# EAGLE design Adafruit HaD Proto HAT rev A (EAGLE 8.5.0)
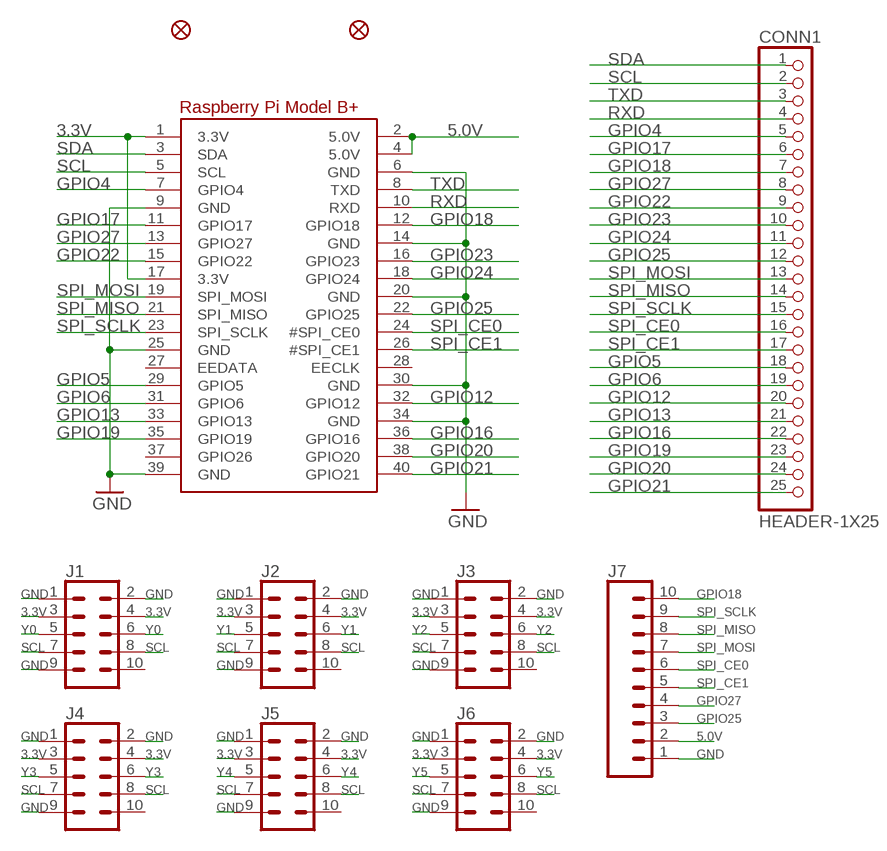
[diagram p0: schematic, sheet 1]

## Parts
CONN1  HEADER-1X25  [1X25_ROUND_70MIL]
FID2  FIDUCIAL""  [FIDUCIAL_1MM]
FID3  FIDUCIAL""  [FIDUCIAL_1MM]
J1  CONN_05X2SHD  [2X5-SHROUDED]
J2  CONN_05X2SHD  [2X5-SHROUDED]
J3  CONN_05X2SHD  [2X5-SHROUDED]
J4  CONN_05X2SHD  [2X5-SHROUDED]
J5  CONN_05X2SHD  [2X5-SHROUDED]
J6  CONN_05X2SHD  [2X5-SHROUDED]
J7  CONN_10LOCK  [1X10_LOCK]
RPI1  RASPBERRYPI_BPLUS_HATNOSLOTS  [PI_HAT_NOSLOTS]

## Nets
3.3V [power]: J1.3 J1.4 J2.3 J2.4 J3.3 J3.4 J4.3 J4.4 J5.3 J5.4 J6.3 J6.4 RPI1.1(3.3V) RPI1.17(3.3V)
5.0V [power]: J7.2 RPI1.2(5.0V) RPI1.4(5.0V)
GND [power]: J1.1 J1.2 J1.9 J2.1 J2.2 J2.9 J3.1 J3.2 J3.9 J4.1 J4.2 J4.9 J5.1 J5.2 J5.9 J6.1 J6.2 J6.9 J7.1 RPI1.6(GND) RPI1.9(GND) RPI1.14(GND) RPI1.20(GND) RPI1.25(GND) RPI1.30(GND) RPI1.34(GND) RPI1.39(GND)
GPIO4: CONN1.5 RPI1.7(GPIO4)
GPIO5: CONN1.18 RPI1.29(GPIO5)
GPIO6: CONN1.19 RPI1.31(GPIO6)
GPIO12: CONN1.20 RPI1.32(GPIO12)
GPIO13: CONN1.21 RPI1.33(GPIO13)
GPIO16: CONN1.22 RPI1.36(GPIO16)
GPIO17: CONN1.6 RPI1.11(GPIO17)
GPIO18: CONN1.7 J7.10 RPI1.12(GPIO18)
GPIO19: CONN1.23 RPI1.35(GPIO19)
GPIO20: CONN1.24 RPI1.38(GPIO20)
GPIO21: CONN1.25 RPI1.40(GPIO21)
GPIO22: CONN1.9 RPI1.15(GPIO22)
GPIO23: CONN1.10 RPI1.16(GPIO23)
GPIO24: CONN1.11 RPI1.18(GPIO24)
GPIO25: CONN1.12 J7.3 RPI1.22(GPIO25)
GPIO27: CONN1.8 J7.4 RPI1.13(GPIO27)
RXD: CONN1.4 RPI1.10(RXD)
SCL: CONN1.2 J1.7 J1.8 J2.7 J2.8 J3.7 J3.8 J4.7 J4.8 J5.7 J5.8 J6.7 J6.8 RPI1.5(SCL)
SDA: CONN1.1 RPI1.3(SDA)
SPI_CE0: CONN1.16 J7.6 RPI1.24(#SPI_CE0)
SPI_CE1: CONN1.17 J7.5 RPI1.26(#SPI_CE1)
SPI_MISO: CONN1.14 J7.8 RPI1.21(SPI_MISO)
SPI_MOSI: CONN1.13 J7.7 RPI1.19(SPI_MOSI)
SPI_SCLK: CONN1.15 J7.9 RPI1.23(SPI_SCLK)
TXD: CONN1.3 RPI1.8(TXD)
Y0 [power]: J1.5 J1.6
Y1 [power]: J2.5 J2.6
Y2 [power]: J3.5 J3.6
Y3 [power]: J4.5 J4.6
Y4 [power]: J5.5 J5.6
Y5 [power]: J6.5 J6.6
Unconnected: J1.10 J2.10 J3.10 J4.10 J5.10 J6.10 RPI1.27(EEDATA) RPI1.28(EECLK) RPI1.37(GPIO26)

## Library data of the parts
CONN1 = microbuilder:HEADER-1X25
FID2 FID3 = microbuilder:FIDUCIAL: Fiducial Alignment Points Various fiducial points for machine vision alignment.; BOM: EXCLUDE
J1-J6 = SparkFun-Connectors:CONN_05X2: Multi connection point. Often used as Generic Header-pin footprint for 0.1 inch spaced/style header connections For AVR SPI programming port, see special device with nice symbol: "AVR_SPI_PROG_5x2.dev" You can populate with any combo of single row headers, but if you'd like an exact match, check these: 2x5 AVR ICSP Male Header <https://www.sparkfun.com/products/778> (PRT-00778) 2x5 Pin Shrouded Header <https://www.sparkfun.com/products/8506> (PRT-08506) On any of the 0.1 inch spaced packages, you can populate with these: Break Away Headers - Straight <https://www.sparkfun.com/products/116> (PRT-00116) Break Away Male Headers - Right Angle <https://www.sparkfun.com/products/553> (PRT-00553) Female Headers <https://www.sparkfun.com/products/115> (PRT-00115) Break Away Headers - Machine Pin <https://www.sparkfun.com/products/117> (PRT-00117) Break Away Female Headers - Swiss Machine Pin <https://www.sparkfun.com/products/743> (PRT-00743) Special note: the shrouded connector mates well with our 5x2 ribbon cables: 2x5 Pin IDC Ribbon Cable <https://www.sparkfun.com/products/8535> (PRT-08535); PROD_ID: CONN-08671; SF_ID: PRT-08506
J7 = SparkFun-Connectors:CONN_10: Multi connection point. Often used as Generic Header-pin footprint for 0.1 inch spaced/style header connections On any of the 0.1 inch spaced packages, you can populate with these: Break Away Headers - Straight <https://www.sparkfun.com/products/116> (PRT-00116) Break Away Male Headers - Right Angle <https://www.sparkfun.com/products/553> (PRT-00553) Female Headers <https://www.sparkfun.com/products/115> (PRT-00115) Break Away Headers - Machine Pin <https://www.sparkfun.com/products/117> (PRT-00117) Break Away Female Headers - Swiss Machine Pin <https://www.sparkfun.com/products/743> (PRT-00743) Arduino Stackable Header - 10 Pin <https://www.sparkfun.com/products/11376> (PRT-11376) For SCREWTERMINALS and SPRING TERMINALS visit here: Screw Terimnals on SparkFun.com <https://www.sparkfun.com/search/results?term=Screw+Terminals> (5mm/3.5mm/2.54mm spacing) This device is also useful as a general connection point to wire up your design to another part of your project. Our various solder wires solder well into these plated through hole pads. Hook-Up Wire - Assortment (Stranded, 22 AWG) <https://www.sparkfun.com/products/11375> (PRT-11375) Hook-Up Wire - Assortment (Solid Core, 22 AWG) <https://www.sparkfun.com/products/11367> (PRT-11367) View the entire wire category on our website here <https://www.sparkfun.com/categories/141> Special notes: Molex polarized connector foot print use with SKU : PRT-08231 with associated crimp pins and housings. 1MM SMD Version SKU: PRT-10208 NOTES ON THE VARIANTS LOCK and LOCK_LONGPADS... This footprint was designed to help hold the alignment of a through-hole component (i.e. 6-pin header) while soldering it into place. You may notice that each hole has been shifted either up or down by 0.005 of an inch from it's more standard position (which is a perfectly straight line). This slight alteration caused the pins (the squares in the middle) to touch the edges of the holes. Because they are alternating, it causes a "brace" to hold the component in place. 0.005 has proven to be the perfect amount of "off-center" position when using our standard breakaway headers. Although looks a little odd when you look at the bare footprint, once you have a header in there, the alteration is very hard to notice. Also,if you push a header all the way into place, it is covered up entirely on the bottom side.
RPI1 = microbuilder:RASPBERRYPI_BPLUS

## Net classes
0 default: width 0.305 mm, clearance 0.254 mm
1 power: width 0.406 mm, clearance 0.254 mm

## Board
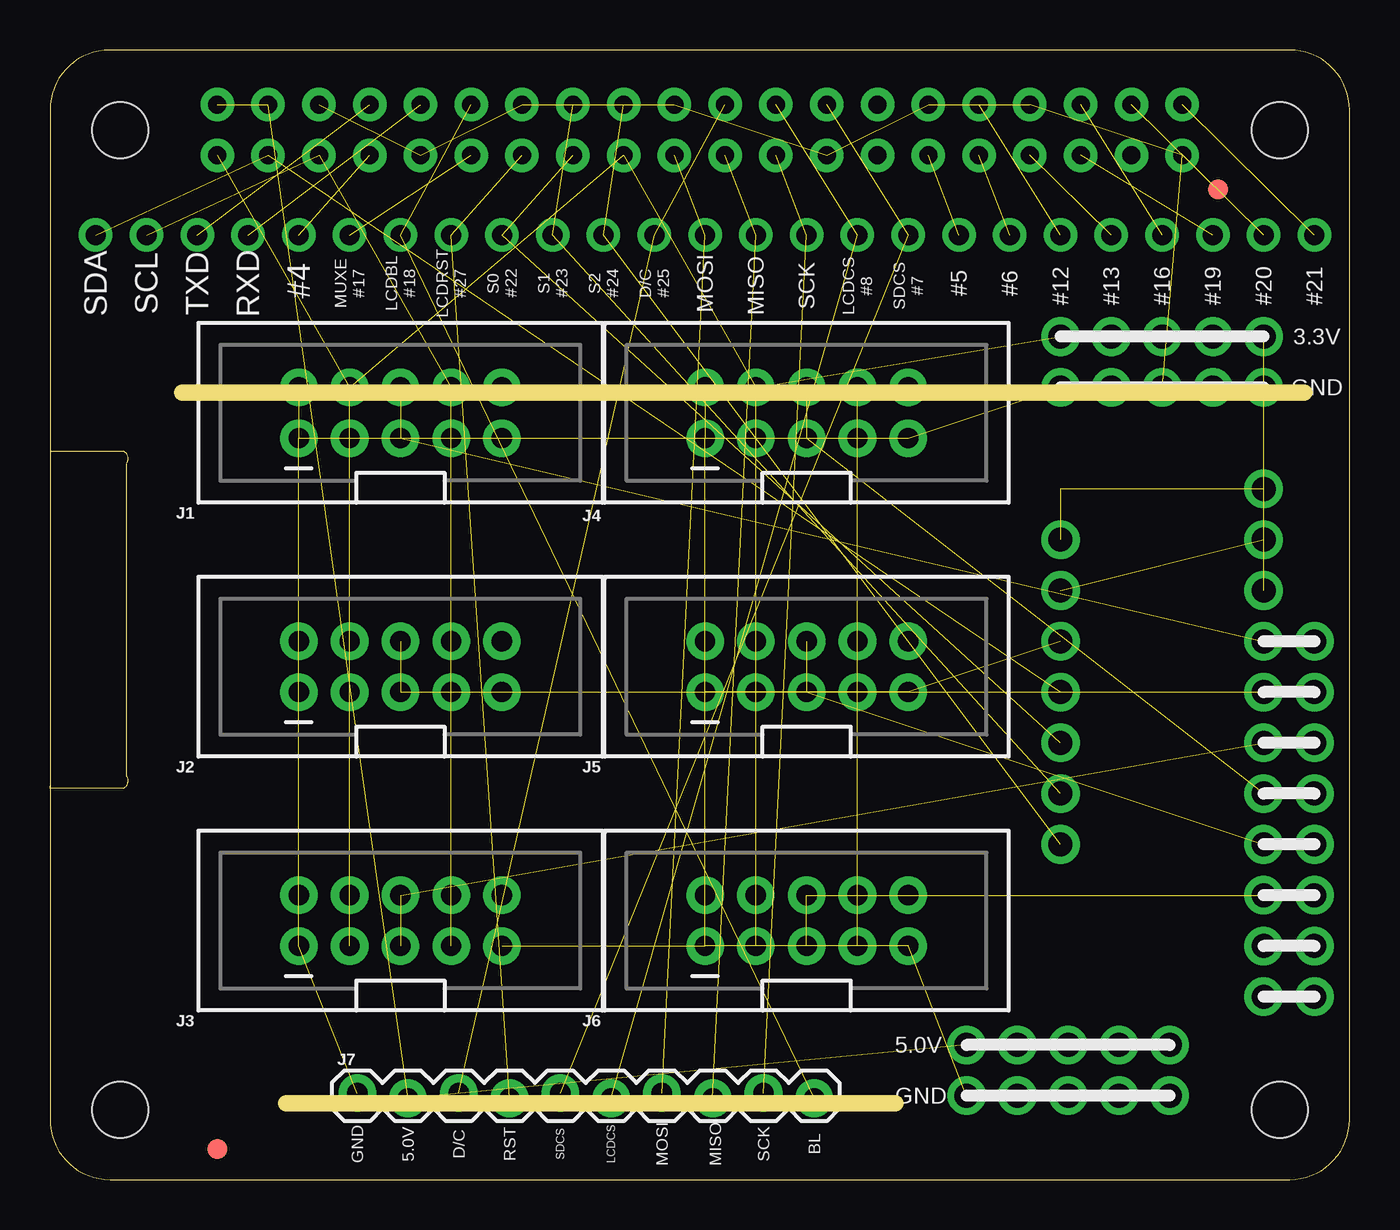
[diagram p1: board, top side]
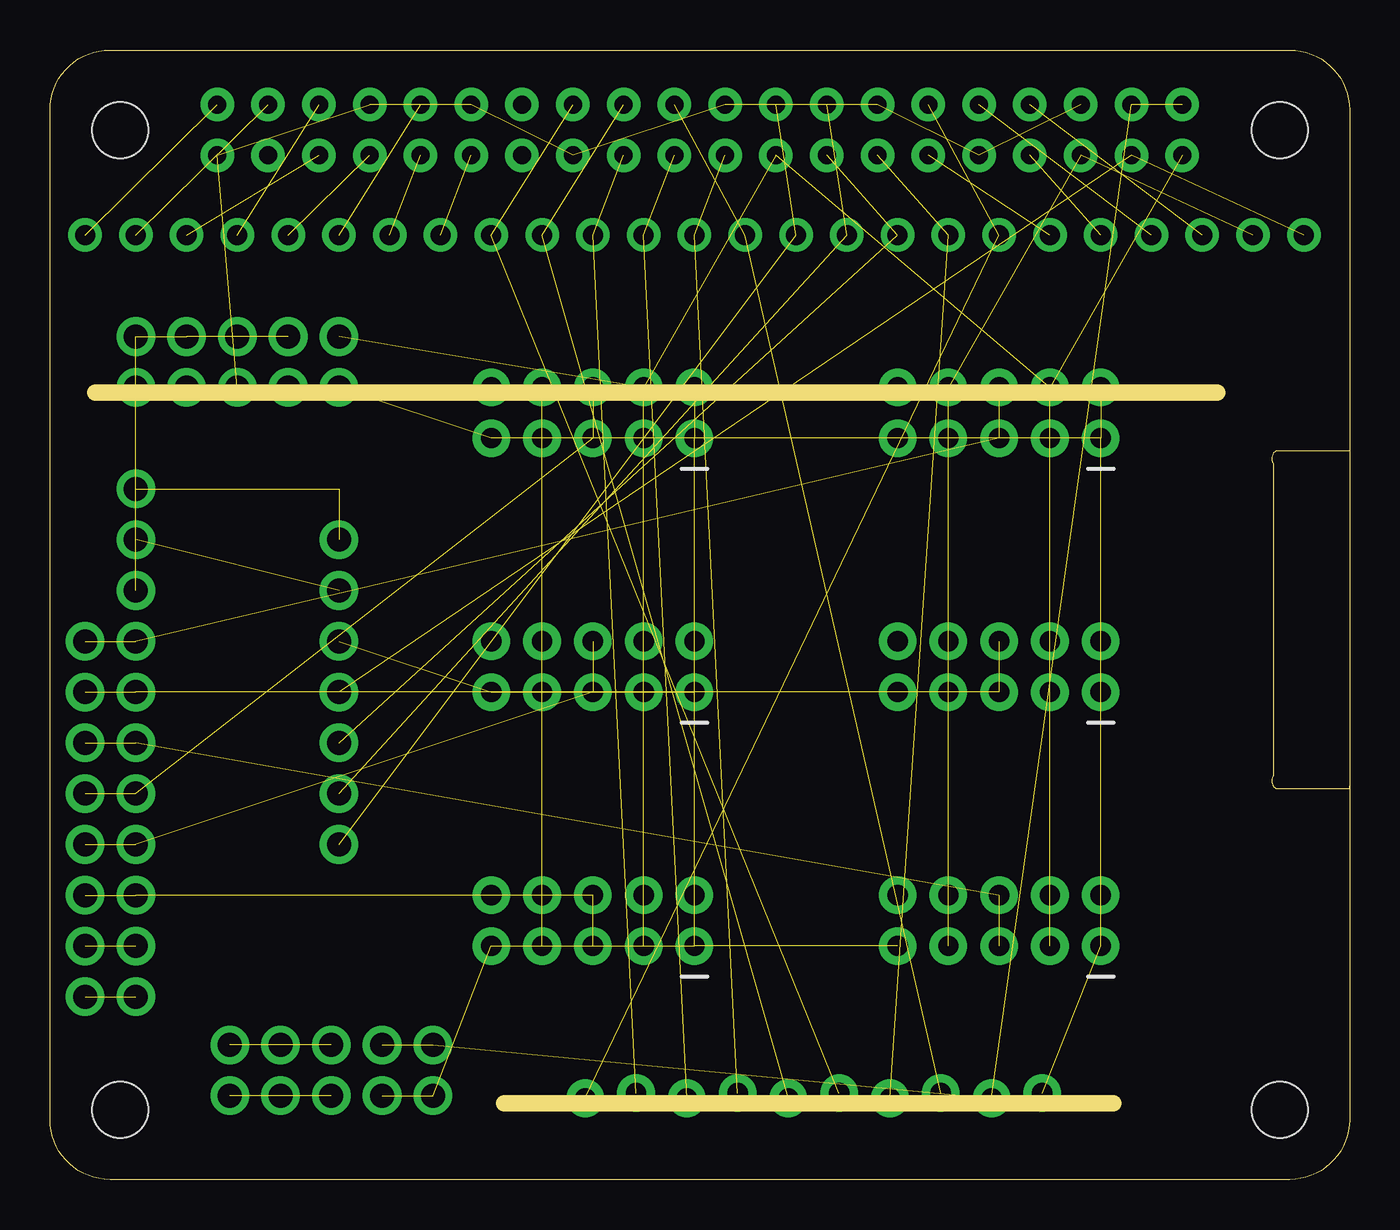
[diagram p2: board, bottom side, seen from below]

Size 65 x 56.5 mm. Coordinates in mm from the lower left corner, seen from the top.
Outline: 0,36.45 3.68,36.45 arc-90 3.81,35.81 3.81,20.19 arc-90 3.68,19.56 0,19.56 0,19.68
Copper layers (1*16): Top 0.035mm / dielectric 1.5mm / Bottom 0.035mm
Design rules "SparkFun": minimum track width 8mil, minimum drill 20mil, track to track 8mil, track to pad 8mil, pad to pad 8mil, via to via 8mil, smd to smd 8mil, copper to edge 10mil, drill to drill 8mil, minimum pad ring 12mil, minimum via ring 10mil, stop-mask expansion 4mil, vias tented up to drill 25mil, thermal gap 10mil
Milling: 2 lines

### Footprints (pad centres in the part's own frame; a part is rotated, then mirrored left to right if it is on the bottom)
1X25_ROUND_70MIL = drill 1 pad 1.676: 1 -30.48,0; 2 -27.94,0; 3 -25.4,0; 4 -22.86,0; 5 -20.32,0; 6 -17.78,0; 7 -15.24,0; 8 -12.7,0; 9 -10.16,0; 10 -7.62,0; 11 -5.08,0; 12 -2.54,0; 13 0,0; 14 2.54,0; 15 5.08,0; 16 7.62,0; 17 10.16,0; 18 12.7,0; 19 15.24,0; 20 17.78,0; 21 20.32,0; 22 22.86,0; 23 25.4,0; 24 27.94,0; 25 30.48,0
FIDUCIAL_1MM = smd 1 x 1: 1 0,0
2X5-SHROUDED = drill 1.016 pad 1.88: 1 -1.27,5.08; 2 1.27,5.08; 3 -1.27,2.54; 4 1.27,2.54; 5 -1.27,0; 6 1.27,0; 7 -1.27,-2.54; 8 1.27,-2.54; 9 -1.27,-5.08; 10 1.27,-5.08
1X10_LOCK = drill 1.016 pad 1.88: 1 0,0.127; 2 2.54,-0.127; 3 5.08,0.127; 4 7.62,-0.127; 5 10.16,0.127; 6 12.7,-0.127; 7 15.24,0.127; 8 17.78,-0.127; 9 20.32,0.127; 10 22.86,-0.127
PI_HAT_NOSLOTS = drill 0.9 pad 1.676: 1 8.37,51.23; 2 8.37,53.77; 3 10.91,51.23; 4 10.91,53.77; 5 13.45,51.23; 6 13.45,53.77; 7 15.99,51.23; 8 15.99,53.77; 9 18.53,51.23; 10 18.53,53.77; 11 21.07,51.23; 12 21.07,53.77; 13 23.61,51.23; 14 23.61,53.77; 15 26.15,51.23; 16 26.15,53.77; 17 28.69,51.23; 18 28.69,53.77; 19 31.23,51.23; 20 31.23,53.77; 21 33.77,51.23; 22 33.77,53.77; 23 36.31,51.23; 24 36.31,53.77; 25 38.85,51.23; 26 38.85,53.77; 27 41.39,51.23; 28 41.39,53.77; 29 43.93,51.23; 30 43.93,53.77; 31 46.47,51.23; 32 46.47,53.77; 33 49.01,51.23; 34 49.01,53.77; 35 51.55,51.23; 36 51.55,53.77; 37 54.09,51.23; 38 54.09,53.77; 39 56.63,51.23; 40 56.63,53.77 | hole 2.8: 3.5,3.5; 3.5,52.5; 61.5,52.5; 61.5,3.5

### Placement (x,y rotation side)
CONN1  32.77,47.24 0 top
FID2  8.38,1.52 0 top
FID3  58.42,49.53 0 top
J1  17.53,38.35 90 top
J2  17.53,25.65 90 top
J3  17.53,12.95 90 top
J4  37.85,38.35 90 top
J5  37.85,25.65 90 top
J6  37.85,12.95 90 top
J7  15.37,4.19 0 top
RPI1  0,0 0 top

### Tracks (layer width: path | path; a pad name or v marks a point on that pad's centre or on a via)
3.3V  (via drill 1.2 pad 1.93)  (19 unrouted)
  Top 0.406: v60.71,42.16 v50.55,42.16
  other vias: 60.71,32 50.55,29.46 53.09,42.16 55.63,42.16 58.17,42.16
5.0V  (via drill 1.2 pad 1.93)  (6 unrouted)
  Top 0.406: v45.85,6.73 v56.01,6.73
  other vias: 48.39,6.73 50.93,6.73 53.47,6.73
GND  (via drill 1.2 pad 1.93)  (37 unrouted)
  Top 0.406: v56.01,4.19 v45.85,4.19
  other vias: 60.71,29.46 50.55,26.92 50.55,39.62 53.09,39.62 55.63,39.62 58.17,39.62 60.71,39.62 48.39,4.19 50.93,4.19 53.47,4.19
GPIO4  (1 unrouted)
GPIO5  (1 unrouted)
GPIO6  (1 unrouted)
GPIO12  (1 unrouted)
GPIO13  (1 unrouted)
GPIO16  (1 unrouted)
GPIO17  (1 unrouted)
GPIO18  (2 unrouted)
GPIO19  (1 unrouted)
GPIO20  (1 unrouted)
GPIO21  (1 unrouted)
GPIO22  (via drill 1.2 pad 1.93)  (2 unrouted)
  other vias: 50.55,21.84
GPIO23  (via drill 1.2 pad 1.93)  (2 unrouted)
  other vias: 50.55,19.3
GPIO24  (via drill 1.2 pad 1.93)  (2 unrouted)
  other vias: 50.55,16.76
GPIO25  (2 unrouted)
GPIO27  (2 unrouted)
RXD  (1 unrouted)
SCL  (13 unrouted)
SDA  (via drill 1.2 pad 1.93)  (2 unrouted)
  other vias: 50.55,24.38
SPI_CE0  (2 unrouted)
SPI_CE1  (2 unrouted)
SPI_MISO  (2 unrouted)
SPI_MOSI  (2 unrouted)
SPI_SCLK  (2 unrouted)
TXD  (1 unrouted)
VEE  (via drill 1.2 pad 1.93)  (2 unrouted)
  other vias: 60.71,34.54 50.55,32
Y0  (via drill 1.2 pad 1.93)  (3 unrouted)
  other vias: 63.25,26.92 60.71,26.92
Y1  (via drill 1.2 pad 1.93)  (3 unrouted)
  other vias: 63.25,24.38 60.71,24.38
Y2  (via drill 1.2 pad 1.93)  (5 unrouted)
  other vias: 63.25,21.84 60.71,21.84
Y3  (via drill 1.2 pad 1.93)  (3 unrouted)
  other vias: 63.25,19.3 60.71,19.3
Y4  (via drill 1.2 pad 1.93)  (3 unrouted)
  other vias: 63.25,16.76 60.71,16.76
Y5  (via drill 1.2 pad 1.93)  (3 unrouted)
  other vias: 63.25,14.22 60.71,14.22
Y6  (via drill 1.2 pad 1.93)  (1 unrouted)
  other vias: 63.25,11.68 60.71,11.68
Y7  (via drill 1.2 pad 1.93)  (1 unrouted)
  other vias: 63.25,9.14 60.71,9.14

### Text on the board
tPlace: SDA | SCL | TXD | RXD | #4 | MUXE / #17 | LCDBL / #18 | LCDRST / #27 | S0 / #22 | S1 / #23 | S2 / #24 | D/C / #25 | MOSI | MISO | SCK | LCDCS / #8 | SDCS / #7 | #5 | #6 | #12 | #13 | #16 | #19 | #20 | #21 | 3.3V | GND | 5.0V | GND | GND | 5.0V | D/C | RST | SDCS | LCDCS | MOSI | MISO | SCK | BL
tSilk: + | + | + | +